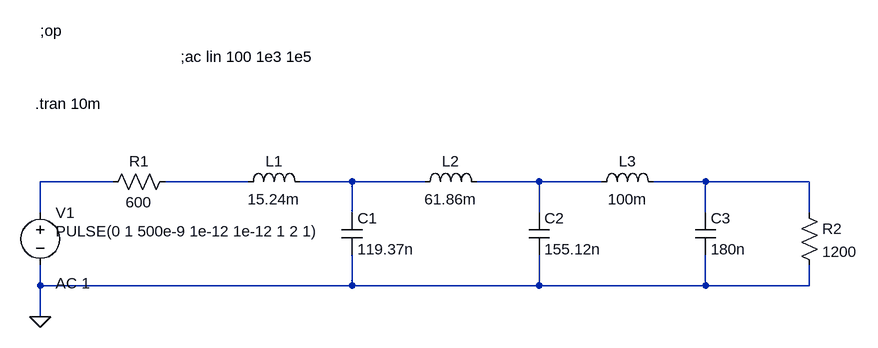
[diagram p0: schematic RLC_Circuit_LTSpice_Analysis.asc]
RLC_Circuit_LTSpice_Analysis.asc, the LTspice schematic file:
Version 4
SHEET 1 1300 680
WIRE 144 96 32 96
WIRE 352 96 224 96
WIRE 512 96 432 96
WIRE 624 96 512 96
WIRE 800 96 704 96
WIRE 896 96 800 96
WIRE 1056 96 976 96
WIRE 1216 96 1056 96
WIRE 32 144 32 96
WIRE 512 144 512 96
WIRE 800 144 800 96
WIRE 1056 144 1056 96
WIRE 1216 144 1216 96
WIRE 32 256 32 224
WIRE 512 256 512 208
WIRE 512 256 32 256
WIRE 800 256 800 208
WIRE 800 256 512 256
WIRE 1056 256 1056 208
WIRE 1056 256 800 256
WIRE 1216 256 1216 224
WIRE 1216 256 1056 256
WIRE 32 304 32 256
FLAG 32 304 0
SYMBOL voltage 32 128 R0
WINDOW 123 24 124 Left 2
WINDOW 39 0 0 Left 0
WINDOW 3 24 44 Left 2
SYMATTR Value2 AC 1
SYMATTR Value PULSE(0 1 500e-9 1e-12 1e-12 1 2 1)
SYMATTR InstName V1
SYMBOL res 240 80 R90
WINDOW 0 0 56 VBottom 2
WINDOW 3 32 56 VTop 2
SYMATTR InstName R1
SYMATTR Value 600
SYMBOL ind 336 112 R270
WINDOW 0 32 56 VTop 2
WINDOW 3 5 56 VBottom 2
SYMATTR InstName L1
SYMATTR Value 15.24m
SYMBOL cap 496 144 R0
SYMATTR InstName C1
SYMATTR Value 119.37n
SYMBOL ind 608 112 R270
WINDOW 0 32 56 VTop 2
WINDOW 3 5 56 VBottom 2
SYMATTR InstName L2
SYMATTR Value 61.86m
SYMBOL cap 784 144 R0
SYMATTR InstName C2
SYMATTR Value 155.12n
SYMBOL ind 880 112 R270
WINDOW 0 32 56 VTop 2
WINDOW 3 5 56 VBottom 2
SYMATTR InstName L3
SYMATTR Value 100m
SYMBOL cap 1040 144 R0
SYMATTR InstName C3
SYMATTR Value 180n
SYMBOL res 1200 128 R0
SYMATTR InstName R2
SYMATTR Value 1200
TEXT 32 -136 Left 2 !;op
TEXT 24 -24 Left 2 !.tran 10m
TEXT 248 -96 Left 2 !;ac lin 100 1e3 1e5

The netlist it stands for:
* RLC_Circuit_LTSpice_Analysis.asc
V1 N001 0 PULSE(0 1 500e-9 1e-12 1e-12 1 2 1) AC 1
R1 N002 N001 600
L1 N002 N003 15.24m
C1 N003 0 119.37n
L2 N003 N004 61.86m
C2 N004 0 155.12n
L3 N004 N005 100m
C3 N005 0 180n
R2 N005 0 1200
;op
.tran 10m
;ac lin 100 1e3 1e5
.backanno
.end